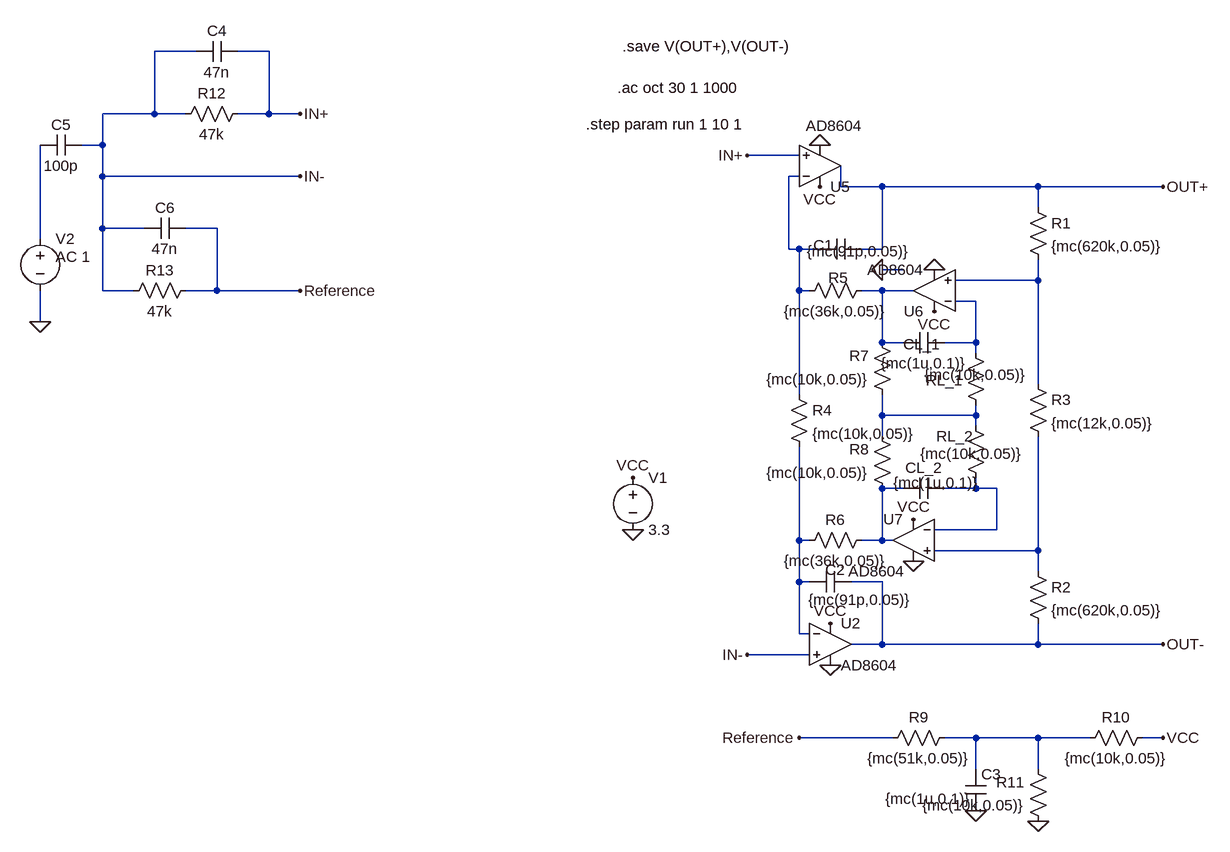
[diagram p0: schematic FDA_AD8604CMGde.asc]
FDA_AD8604CMGde.asc, the LTspice schematic file:
Version 4
SHEET 1 1520 820
WIRE -592 -384 -656 -384
WIRE -480 -384 -528 -384
WIRE -656 -288 -656 -384
WIRE -656 -288 -736 -288
WIRE -608 -288 -656 -288
WIRE -480 -288 -480 -384
WIRE -480 -288 -528 -288
WIRE -432 -288 -480 -288
WIRE -736 -240 -736 -288
WIRE -736 -240 -768 -240
WIRE 336 -224 256 -224
WIRE -736 -192 -736 -240
WIRE -432 -192 -736 -192
WIRE 336 -192 320 -192
WIRE 400 -176 400 -208
WIRE 464 -176 400 -176
WIRE 704 -176 464 -176
WIRE 896 -176 704 -176
WIRE 704 -144 704 -176
WIRE -736 -112 -736 -192
WIRE -672 -112 -736 -112
WIRE -560 -112 -608 -112
WIRE -832 -96 -832 -240
WIRE 320 -80 320 -192
WIRE 336 -80 320 -80
WIRE 368 -80 336 -80
WIRE 464 -80 464 -176
WIRE 464 -80 432 -80
WIRE 496 -48 464 -48
WIRE 704 -32 704 -64
WIRE 704 -32 576 -32
WIRE -736 -16 -736 -112
WIRE -688 -16 -736 -16
WIRE -560 -16 -560 -112
WIRE -560 -16 -608 -16
WIRE -432 -16 -560 -16
WIRE 336 -16 336 -80
WIRE 352 -16 336 -16
WIRE 464 -16 432 -16
WIRE 512 -16 464 -16
WIRE 608 0 576 0
WIRE -832 32 -832 -16
WIRE 464 64 464 -16
WIRE 496 64 464 64
WIRE 608 64 608 0
WIRE 608 64 560 64
WIRE 608 80 608 64
WIRE 704 128 704 -32
WIRE 336 144 336 -16
WIRE 464 176 464 144
WIRE 608 176 608 160
WIRE 608 176 464 176
WIRE 608 192 608 176
WIRE 464 208 464 176
WIRE 496 288 464 288
WIRE 608 288 608 272
WIRE 608 288 560 288
WIRE 640 288 608 288
WIRE 640 352 640 288
WIRE 640 352 544 352
WIRE 336 368 336 224
WIRE 352 368 336 368
WIRE 464 368 464 288
WIRE 464 368 432 368
WIRE 480 368 464 368
WIRE 704 384 704 208
WIRE 704 384 544 384
WIRE 704 416 704 384
WIRE 336 432 336 368
WIRE 352 432 336 432
WIRE 464 432 416 432
WIRE 336 512 336 432
WIRE 352 512 336 512
WIRE 464 528 464 432
WIRE 464 528 416 528
WIRE 704 528 704 496
WIRE 704 528 464 528
WIRE 896 528 704 528
WIRE 352 544 256 544
WIRE 480 672 336 672
WIRE 608 672 560 672
WIRE 704 672 608 672
WIRE 784 672 704 672
WIRE 896 672 864 672
WIRE 608 720 608 672
WIRE 704 720 704 672
FLAG 896 -176 OUT+
FLAG 896 528 OUT-
FLAG 256 -224 IN+
FLAG 256 544 IN-
FLAG -432 -288 IN+
FLAG 80 352 0
FLAG 80 272 VCC
FLAG 464 -48 0
FLAG 368 -176 VCC
FLAG 384 496 VCC
FLAG 384 560 0
FLAG 368 -240 0
FLAG 336 672 Reference
FLAG 608 784 0
FLAG 704 800 0
FLAG 896 672 VCC
FLAG -432 -192 IN-
FLAG -432 -16 Reference
FLAG 544 -48 0
FLAG 544 16 VCC
FLAG 512 400 0
FLAG 512 336 VCC
FLAG -832 32 0
SYMBOL cap 432 -96 R90
WINDOW 0 26 59 VBottom 2
WINDOW 3 4 4 VTop 2
SYMATTR InstName C1
SYMATTR Value {mc(91p,0.05)}
SYMBOL cap 416 416 R90
WINDOW 0 13 24 VBottom 2
WINDOW 3 28 -14 VTop 2
SYMATTR InstName C2
SYMATTR Value {mc(91p,0.05)}
SYMBOL cap 560 48 R90
WINDOW 0 34 35 VBottom 2
WINDOW 3 32 32 VTop 2
SYMATTR InstName CL_1
SYMATTR Value {mc(1u,0.1)}
SYMBOL cap 560 272 R90
WINDOW 0 0 32 VBottom 2
WINDOW 3 -8 13 VTop 2
SYMATTR InstName CL_2
SYMATTR Value {mc(1u,0.1)}
SYMBOL res 688 -160 R0
SYMATTR InstName R1
SYMATTR Value {mc(620k,0.05)}
SYMBOL res 688 400 R0
SYMATTR InstName R2
SYMATTR Value {mc(620k,0.05)}
SYMBOL res 688 112 R0
SYMATTR InstName R3
SYMATTR Value {mc(12k,0.05)}
SYMBOL res 320 128 R0
SYMATTR InstName R4
SYMATTR Value {mc(10k,0.05)}
SYMBOL res 448 -32 R90
WINDOW 0 12 52 VBottom 2
WINDOW 3 32 56 VTop 2
SYMATTR InstName R5
SYMATTR Value {mc(36k,0.05)}
SYMBOL res 448 352 R90
WINDOW 0 0 56 VBottom 2
WINDOW 3 32 56 VTop 2
SYMATTR InstName R6
SYMATTR Value {mc(36k,0.05)}
SYMBOL res 624 176 R180
WINDOW 0 35 54 Left 2
WINDOW 3 -63 63 Left 2
SYMATTR InstName RL_1
SYMATTR Value {mc(10k,0.05)}
SYMBOL res 480 160 R180
WINDOW 0 36 76 Left 2
WINDOW 3 36 40 Left 2
SYMATTR InstName R7
SYMATTR Value {mc(10k,0.05)}
SYMBOL res 480 304 R180
WINDOW 0 36 76 Left 2
WINDOW 3 36 40 Left 2
SYMATTR InstName R8
SYMATTR Value {mc(10k,0.05)}
SYMBOL res 624 288 R180
WINDOW 0 19 80 Left 2
WINDOW 3 -57 53 Left 2
SYMATTR InstName RL_2
SYMATTR Value {mc(10k,0.05)}
SYMBOL voltage 80 256 R0
WINDOW 123 0 0 Left 0
WINDOW 39 0 0 Left 0
SYMATTR InstName V1
SYMATTR Value 3.3
SYMBOL res 576 656 R90
WINDOW 0 0 56 VBottom 2
WINDOW 3 32 56 VTop 2
SYMATTR InstName R9
SYMATTR Value {mc(51k,0.05)}
SYMBOL res 880 656 R90
WINDOW 0 0 56 VBottom 2
WINDOW 3 32 56 VTop 2
SYMATTR InstName R10
SYMATTR Value {mc(10k,0.05)}
SYMBOL res 720 816 R180
WINDOW 0 36 76 Left 2
WINDOW 3 36 40 Left 2
SYMATTR InstName R11
SYMATTR Value {mc(10k,0.05)}
SYMBOL cap 592 720 R0
WINDOW 3 -123 46 Left 2
SYMATTR InstName C3
SYMATTR Value {mc(1u,0.1)}
SYMBOL voltage -832 -112 R0
WINDOW 123 24 44 Left 2
WINDOW 39 0 0 Left 0
WINDOW 3 -130 108 Left 2
SYMATTR Value2 AC 1
SYMATTR Value ""
SYMATTR InstName V2
SYMBOL OpAmps\\AD8604 368 -144 M180
WINDOW 3 -22 126 Left 2
SYMATTR InstName U5
SYMBOL OpAmps\\AD8604 544 48 R180
SYMATTR InstName U6
SYMBOL OpAmps\\AD8604 512 304 M0
WINDOW 3 13 112 Left 2
SYMATTR InstName U7
SYMBOL cap -528 -400 R90
WINDOW 0 0 32 VBottom 2
WINDOW 3 32 32 VTop 2
SYMATTR InstName C4
SYMATTR Value 47n
SYMBOL res -512 -304 R90
WINDOW 0 0 56 VBottom 2
WINDOW 3 32 56 VTop 2
SYMATTR InstName R12
SYMATTR Value 47k
SYMBOL cap -832 -224 R270
WINDOW 0 32 32 VTop 2
WINDOW 3 0 32 VBottom 2
SYMATTR InstName C5
SYMATTR Value 100p
SYMBOL cap -608 -128 R90
WINDOW 0 0 32 VBottom 2
WINDOW 3 32 32 VTop 2
SYMATTR InstName C6
SYMATTR Value 47n
SYMBOL res -592 -32 R90
WINDOW 0 0 56 VBottom 2
WINDOW 3 32 56 VTop 2
SYMATTR InstName R13
SYMATTR Value 47k
SYMBOL OpAmps\\AD8604 384 464 R0
SYMATTR InstName U2
TEXT 56 -328 Left 2 !.ac oct 30 1 1000
TEXT 8 -272 Left 2 !.step param run 1 10 1
TEXT 64 -392 Left 2 !.save V(OUT+),V(OUT-)

The netlist it stands for:
* FDA_AD8604CMGde.asc
C1 OUT+ N001 {mc(91p,0.05)}
C2 OUT- N009 {mc(91p,0.05)}
CL_1 N005 N004 {mc(1u,0.1)}
CL_2 N008 N007 {mc(1u,0.1)}
R1 OUT+ N003 {mc(620k,0.05)}
R2 N010 OUT- {mc(620k,0.05)}
R3 N003 N010 {mc(12k,0.05)}
R4 N001 N009 {mc(10k,0.05)}
R5 N004 N001 {mc(36k,0.05)}
R6 N007 N009 {mc(36k,0.05)}
RL_1 N006 N005 {mc(10k,0.05)}
R7 N006 N004 {mc(10k,0.05)}
R8 N007 N006 {mc(10k,0.05)}
RL_2 N008 N006 {mc(10k,0.05)}
V1 VCC 0 3.3
R9 N011 Reference {mc(51k,0.05)}
R10 VCC N011 {mc(10k,0.05)}
R11 0 N011 {mc(10k,0.05)}
C3 N011 0 {mc(1u,0.1)}
V2 N002 0 AC 1
XU5 IN+ N001 VCC 0 OUT+ AD8604  ; pins In+ In- V+ V- OUT
XU6 N003 N005 VCC 0 N004 AD8604  ; pins In+ In- V+ V- OUT
XU7 N010 N008 VCC 0 N007 AD8604  ; pins In+ In- V+ V- OUT
C4 IN+ IN- 47n
R12 IN+ IN- 47k
C5 N002 IN- 100p
C6 Reference IN- 47n
R13 Reference IN- 47k
XU2 IN- N009 VCC 0 OUT- AD8604  ; pins In+ In- V+ V- OUT
.ac oct 30 1 1000
.step param run 1 10 1
.save V(OUT+),V(OUT-)
.backanno
.end